# Altium schematic sheet UART.SchDoc
size A4
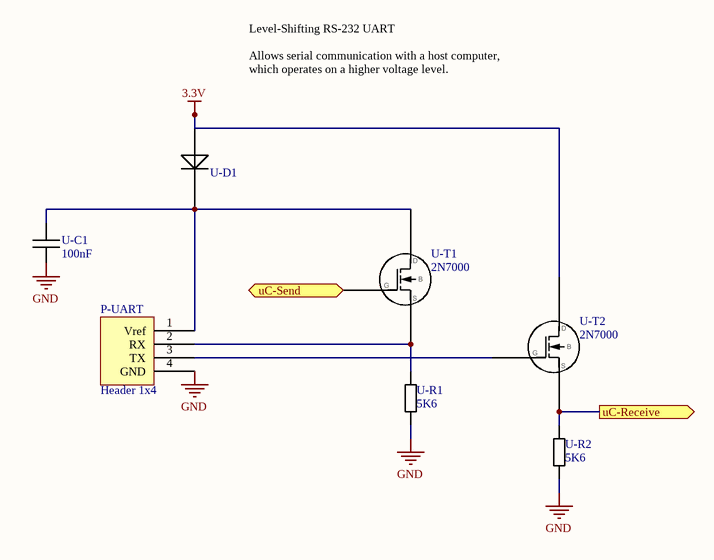
[diagram p0: UART.SchDoc]

## Parts
P-UART  Header 1x4  [Header 1x4]
U-C1  100nF  [C 0805 / 2012]
U-D1  Diode  [SC-90]  (value not drawn)
U-R1  5K6  [R 0805 / 2012]
U-R2  5K6  [R 0805 / 2012]
U-T1  2N7000  [SOT-23-3]
U-T2  2N7000  [SOT-23-3]

## Ports
uC-Receive (out), uC-Send (in)

## Nets
3.3V: U-D1.2 U-T2.3
GND: P-UART.4(GND) U-C1.2 U-R1.2 U-R2.2
uC-Receive: U-R2.1 U-T2.2 ; port uC-Receive
uC-Send: U-T1.1 ; port uC-Send
NetP-UART_1: P-UART.1(Vref) U-C1.1 U-D1.1 U-T1.3
NetP-UART_2: P-UART.2(RX) U-R1.1 U-T1.2
NetP-UART_3: P-UART.3(TX) U-T2.1

## Notes on the sheet
- Level-Shifting RS-232 UART
  Allows serial communication with a host computer,
  which operates on a higher voltage level.

## Library data of the parts
P-UART = Header UART
U-C1 = Capacitor
U-R1 U-R2 = Resistor
U-T1 U-T2 = 2N7000: N-FET